# Altium project VESC_POWER_75100.PrjPcb
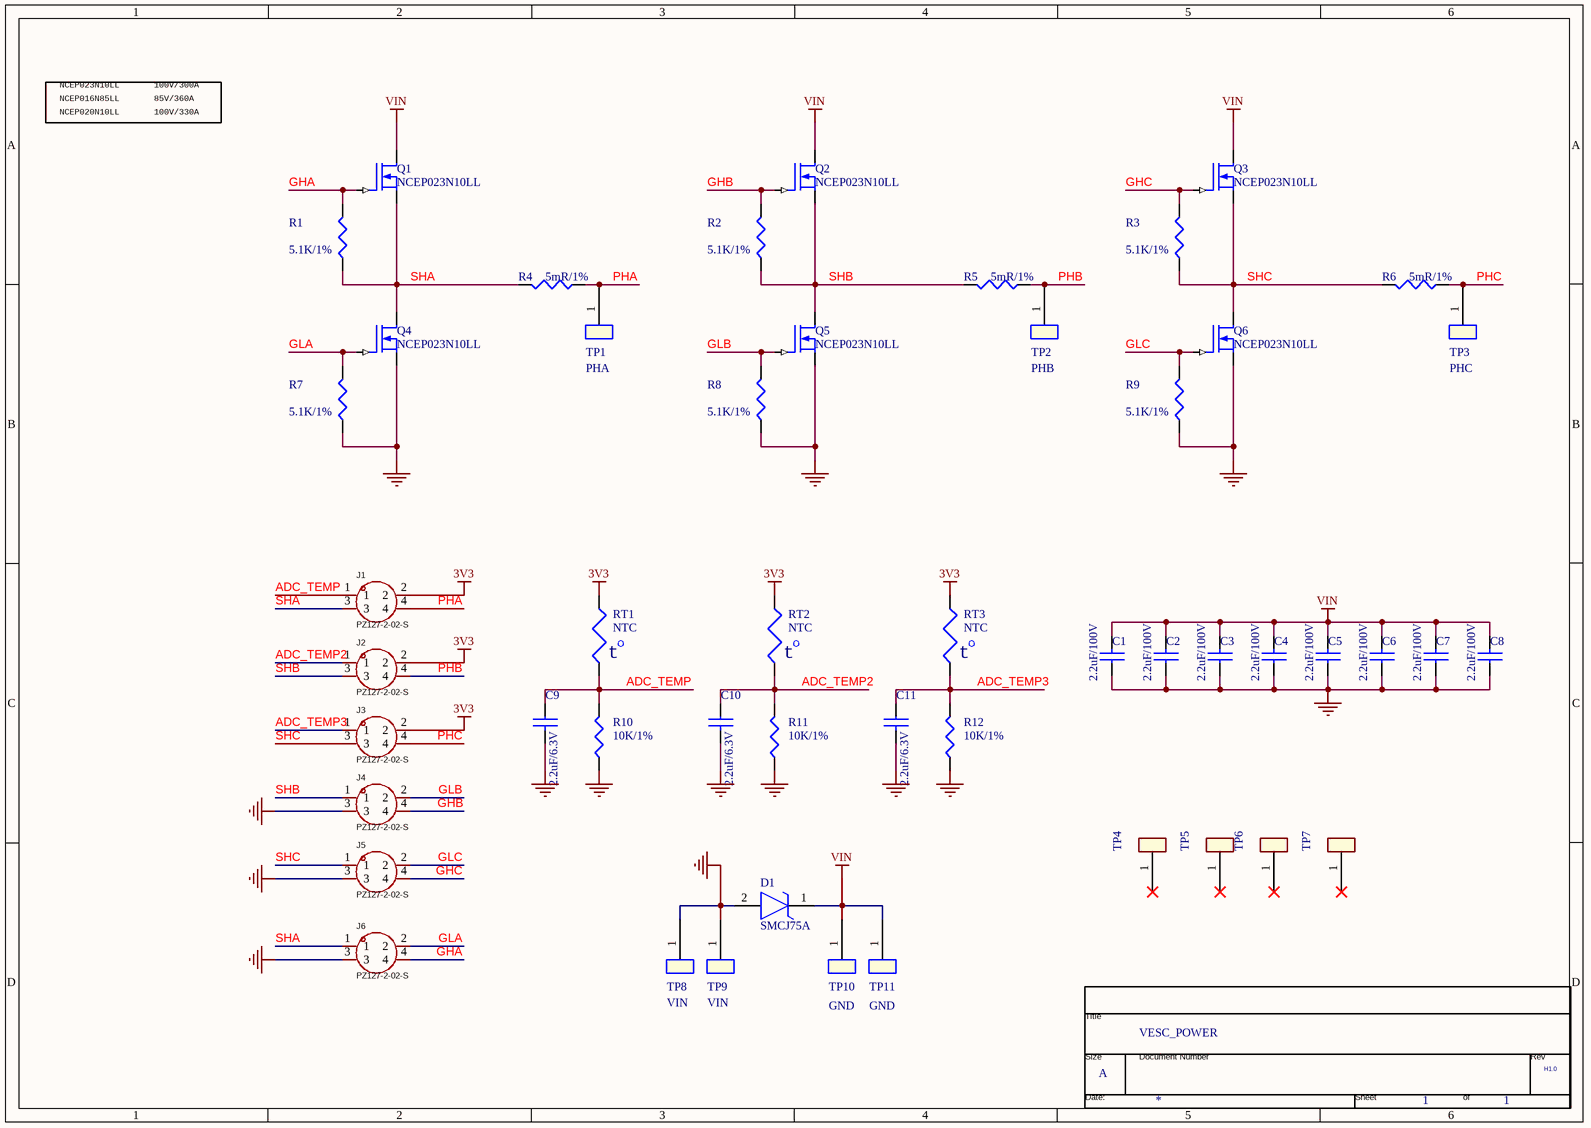
[diagram p0: VESC_POWER_75100_SCH.SchDoc]
1 sheet, 51 parts. Net scope: global (net labels, ports and power ports of the same name join across sheets).
Board file: VESC_POWER_75100.PcbDoc

## Sheet VESC_POWER_75100_SCH.SchDoc
size 297 x 209 mm

### Parts
*  RevCode: H1.0  Title: VESC_POWER  Page Size: A  Page Number: 1  (hidden comment: TitleBlock0)  (graphical)
C1  2.2uF/100V  [CAPC3225X230N]
C2  2.2uF/100V  [CAPC3225X230N]
C3  2.2uF/100V  [CAPC3225X230N]
C4  2.2uF/100V  [CAPC3225X230N]
C5  2.2uF/100V  [CAPC3225X230N]
C6  2.2uF/100V  [CAPC3225X230N]
C7  2.2uF/100V  [CAPC3225X230N]
C8  2.2uF/100V  [CAPC3225X230N]
C9  2.2uF/6.3V  [C0603]
C10  2.2uF/6.3V  [C0603]
C11  2.2uF/6.3V  [C0603]
D1  SMCJ75A  [DIOM7959X262N]
J1  PZ127-2-02-S  [HDR-SMD_4P-P1.27-V-M-R2-C2-LS5.3]
J2  PZ127-2-02-S  [HDR-SMD_4P-P1.27-V-M-R2-C2-LS5.3]
J3  PZ127-2-02-S  [HDR-SMD_4P-P1.27-V-M-R2-C2-LS5.3]
J4  PZ127-2-02-S  [HDR-SMD_4P-P1.27-V-M-R2-C2-LS5.3]
J5  PZ127-2-02-S  [HDR-SMD_4P-P1.27-V-M-R2-C2-LS5.3]
J6  PZ127-2-02-S  [HDR-SMD_4P-P1.27-V-M-R2-C2-LS5.3]
Q1  NCEP023N10LL  [TOLL]
Q2  NCEP023N10LL  [TOLL]
Q3  NCEP023N10LL  [TOLL]
Q4  NCEP023N10LL  [TOLL]
Q5  NCEP023N10LL  [TOLL]
Q6  NCEP023N10LL  [TOLL]
R1  5.1K/1%  [R0603]
R2  5.1K/1%  [R0603]
R3  5.1K/1%  [R0603]
R4  5mR/1%  [R2512]
R5  5mR/1%  [R2512]
R6  5mR/1%  [R2512]
R7  5.1K/1%  [R0603]
R8  5.1K/1%  [R0603]
R9  5.1K/1%  [R0603]
R10  10K/1%  [R0603]
R11  10K/1%  [R0603]
R12  10K/1%  [R0603]
RT1  NTC  [R0603]
RT2  NTC  [R0603]
RT3  NTC  [R0603]
TP1  PHA  [TP_8x8]
TP2  PHB  [TP_8x8]
TP3  PHC  [TP_8x8]
TP4  TEST POINT  [HOLE-3.2MM_M]  (value not drawn)
TP5  TEST POINT  [HOLE-3.2MM_M]  (value not drawn)
TP6  TEST POINT  [HOLE-3.2MM_M]  (value not drawn)
TP7  TEST POINT  [HOLE-3.2MM_M]  (value not drawn)
TP8  VIN  [TP_6x6]
TP9  VIN  [TP_8x8]
TP10  GND  [TP_8x8]
TP11  GND  [TP_6x6]

### Nets
3V3: J1.2 J2.2 J3.2 RT1.1 RT2.1 RT3.1
GND: C1.1 C2.1 C3.1 C4.1 C5.1 C6.1 C7.1 C8.1 C9.2 C10.2 C11.2 D1.2(A) J4.3 J5.3 J6.3 Q4.3(SOURCE) Q5.3(SOURCE) Q6.3(SOURCE) R7.1 R8.1 R9.1 R10.1 R11.1 R12.1 TP8.1 TP9.1
VIN: C1.2 C2.2 C3.2 C4.2 C5.2 C6.2 C7.2 C8.2 D1.1(K) Q1.2(DRAIN) Q2.2(DRAIN) Q3.2(DRAIN) TP10.1 TP11.1
ADC_TEMP: C9.1 J1.1 R10.2 RT1.2
ADC_TEMP2: C10.1 J2.1 R11.2 RT2.2
ADC_TEMP3: C11.1 J3.1 R12.2 RT3.2
GHA: J6.4 Q1.1(GATE) R1.2
GHB: J4.4 Q2.1(GATE) R2.2
GHC: J5.4 Q3.1(GATE) R3.2
GLA: J6.2 Q4.1(GATE) R7.2
GLB: J4.2 Q5.1(GATE) R8.2
GLC: J5.2 Q6.1(GATE) R9.2
PHA: J1.4 R4.1 TP1.1
PHB: J2.4 R5.1 TP2.1
PHC: J3.4 R6.1 TP3.1
SHA: J1.3 J6.1 Q1.3(SOURCE) Q4.2(DRAIN) R1.1 R4.2
SHB: J2.3 J4.1 Q2.3(SOURCE) Q5.2(DRAIN) R2.1 R5.2
SHC: J3.3 J5.1 Q3.3(SOURCE) Q6.2(DRAIN) R3.1 R6.2

Not connected (* = marked no-connect by the designer): TP4 1*; TP5 1*; TP6 1*; TP7 1*

### Notes on the sheet
- NCEP023N10LL
- NCEP020N10LL
- NCEP016N85LL
- 85V/360A
- 100V/330A
- 100V/300A
- (in symbol NTC) t
- (in symbol TitleBlock0) Title; Size; Document Number; Rev; Date:; Sheet; of

### Library data of the parts
C1-C8 = CAP NP: PCB Footprint: C1206
C9-C11 = CAP NP: PCB Footprint: C0603
D1 = SMCJ75A: TVS Diode (Uni-directional); Manufacturer_Name: Bourns; Datasheet Link: https://www.bourns.com/docs/Product-Datasheets/SMCJ.pdf; Height: 2.62mm; Manufacturer_Part_Number: SMCJ75A; Mouser Part Number: 652-SMCJ75A; Mouser Price/Stock: https://www.mouser.co.uk/ProductDetail/Bourns/SMCJ75A?qs=%252Bf8Cd6aE5bzxrdYbQ%252Bf9mA%3D%3D; Arrow Part Number: SMCJ75A; Arrow Price/Stock: https://www.arrow.com/en/products/smcj75a/bourns?region=nac
J1-J6 = PZ127-2-02-S: Manufacturer: HCTL(华灿天禄); Add into BOM: yes; Pin Structure: 2x2P; Pitch: 1.27mm; Circluar Pins/Square Pins: 方针; Current Rating (Max): 1A; Soldering Temperature(Max): 260℃@10S; Symbol: PZ127-2-02-S; Device: PZ127-2-02-S; LCSC Part Name: 2x2P 间距:1.27mm 方针 立贴; Supplier Part: C3975185; Manufacturer Part: PZ127-2-02-S; Supplier Footprint: SMD,P=1.27mm; JLCPCB Part Class: Extended Part; Datasheet: https://atta.szlcsc.com/upload/public/pdf/source/20230609/2ACB07ADC7D4DAF6D292F3D23C037F6C.pdf; Supplier: LCSC; Convert to PCB: yes; Row Spacing: 1.27mm; Mounting Type: 立贴; Number of Rows: 双排; Number of Pins: 4P; Length of Mating Pin: 4mm; Insulation Height: 1.5mm; Length of End Connection Pin: -; Contact Material: 黄铜; Operating Temperature Range: -40℃~+105℃; Color: 黑色
Q1-Q6 = MOSFET N: PCB Footprint: TOLL
R1-R3 R7-R12 = RESISTOR: PCB Footprint: R0603
R4-R6 = RESISTOR: PCB Footprint: R3920
TP1-TP3 TP9 TP10 = TEST POINT: PCB Footprint: TP_8x8
TP8 TP11 = TEST POINT: PCB Footprint: TP_8x8
* = TitleBlock0: Page Create Date: March  8, 1995; Page Count: 1; Page Modify Date: *
RT1-RT3 = NTC: PCB Footprint: R0603